# EAGLE design VolRegModule (EAGLE 9.6.2)
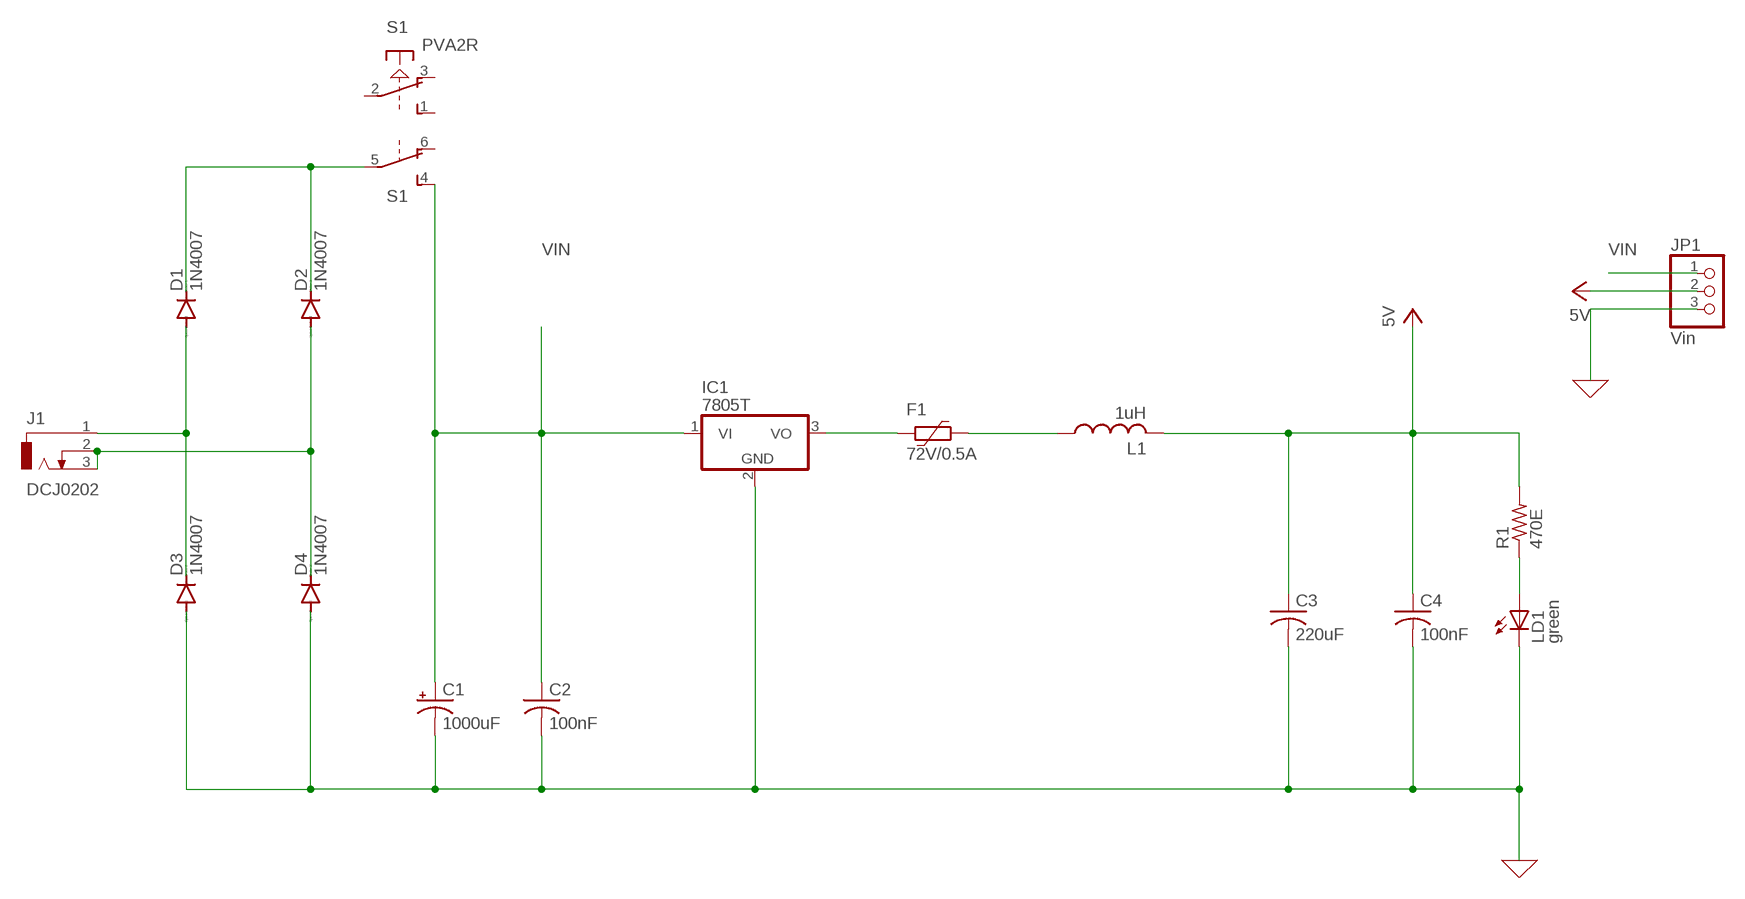
[diagram p0: schematic, sheet 1]

## Parts
C1  1000uF  CPOL-USE5-13  [E5-13]
C2  100nF  C-USC0805  [C0805]
C3  220uF  C-USC0805  [C0805]
C4  100nF  C-USC0805  [C0805]
D1  1N4007  1N4004  [DO41-10]
D2  1N4007  1N4004  [DO41-10]
D3  1N4007  1N4004  [DO41-10]
D4  1N4007  1N4004  [DO41-10]
F1  72V/0.5A  1812L350SL  [1812L]
IC1  7805T  [TO220H]
J1  DCJ0202  [DCJ0202]
JP1  Vin  PINHD-1X03_2.54  [1X03]
L1  1uH  L-USL0805  [L0805]
LD1  green  LEDCHIP-LED0805  [CHIP-LED0805]
R1  470E  R-US_R0805  [R0805]
S1  PVA2R  [PVA2R]

## Nets
0: C1.- C2.2 C3.2 C4.2 D3.A D4.A IC1.2(GND) JP1.3 LD1.C ; supply symbol labelled GND
N$1: D1.A D3.C J1.1
N$2: D1.C D2.C S1.5(2:P)
N$3: F1.2 IC1.3(VO)
N$4: F1.1 L1.1
N$5: D2.A D4.C J1.2 J1.3
N$7: LD1.A R1.1
VCC: C3.1 C4.1 JP1.2 L1.2 R1.2 ; supply symbol labelled 5V
VIN: C1.+ C2.1 IC1.1(VI) JP1.1 S1.4(2:S)
Unconnected: S1.1(1:S) S1.2(1:P) S1.3(1:O) S1.6(2:O)

## Library data of the parts
C1 = rcl:CPOL-US: POLARIZED CAPACITOR, American symbol; SPICEPREFIX: C
C2-C4 = rcl (1):C-US: CAPACITOR, American symbol
D1-D4 = diode:1N4004: DIODE general purpose rectifier, 1 A
F1 = polyfuse-smd_10:?: Polyfuse Resettable PTC Source: http://www.littelfuse.com/products/resettable-ptcs.aspx; MF: Littelfuse; MPN: 1812L350SL; OC_FARNELL: 2125911; OC_NEWARK: 88T7690
IC1 = linear:78*: Positive VOLTAGE REGULATOR Source: http://cache.national.com/ds/LM/LM78L05.pdf http://www.fairchildsemi.com/ds/LM/LM7805.pdf
J1 = con-jack:DCJ0202: DC POWER JACK Source: DCJ0202.pdf; OC_FARNELL: unknown; OC_NEWARK: unknown
JP1 = pinhead-2:PINHD-1X03: PIN HEADER
L1 = rcl (1):L-US: INDUCTOR, American symbol
LD1 = led(1):LED: LED OSRAM: - CHIPLED LG R971, LG N971, LY N971, LG Q971, LY Q971, LO R971, LY R971 LH N974, LH R974 LS Q976, LO Q976, LY Q976 LO Q996 - Hyper CHIPLED LW Q18S LB Q993, LB Q99A, LB R99A - SideLED LS A670, LO A670, LY A670, LG A670, LP A670 LB A673, LV A673, LT A673, LW A673 LH A674 LY A675 LS A676, LA A676, LO A676, LY A676, LW A676 LS A679, LY A679, LG A679 - Hyper Micro SIDELED® LS Y876, LA Y876, LO Y876, LY Y876 LT Y87S - SmartLED LW L88C, LW L88S LB L89C, LB L89S, LG L890 LS L89K, LO L89K, LY L89K LS L896, LA L896, LO L896, LY L896 - TOPLED LS T670, LO T670, LY T670, LG T670, LP T670 LSG T670, LSP T670, LSY T670, LOP T670, LYG T670 LG T671, LOG T671, LSG T671 LB T673, LV T673, LT T673, LW T673 LH T674 LS T676, LA T676, LO T676, LY T676, LB T676, LH T676, LSB T676, LW T676 LB T67C, LV T67C, LT T67C, LS T67K, LO T67K, LY T67K, LW E67C LS E67B, LA E67B, LO E67B, LY E67B, LB E67C, LV E67C, LT E67C LW T67C LS T679, LY T679, LG T679 LS T770, LO T770, LY T770, LG T770, LP T770 LB T773, LV T773, LT T773, LW T773 LH T774 LS E675, LA E675, LY E675, LS T675 LS T776, LA T776, LO T776, LY T776, LB T776 LHGB T686 LT T68C, LB T68C - Hyper Mini TOPLED® LB M676 - Mini TOPLED Santana® LG M470 LS M47K, LO M47K, LY M47K Source: http://www.osram.convergy.de/
R1 = rcl (1):R-US_: RESISTOR, American symbol
S1 = switch-misc:PVA2R: ITT SWITCH

## Board
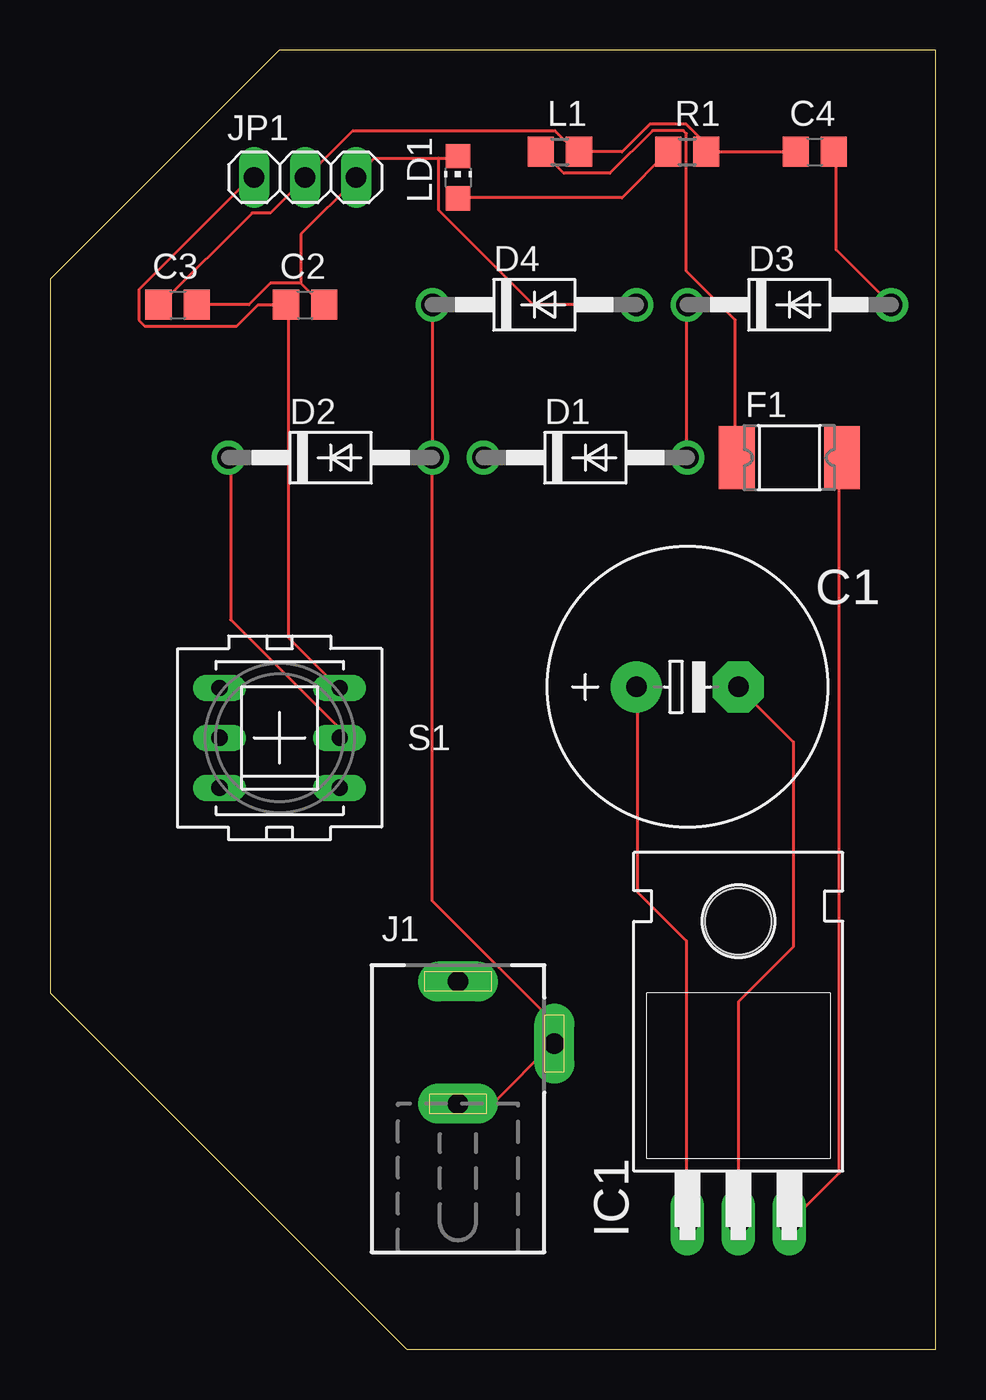
[diagram p1: board, top side]
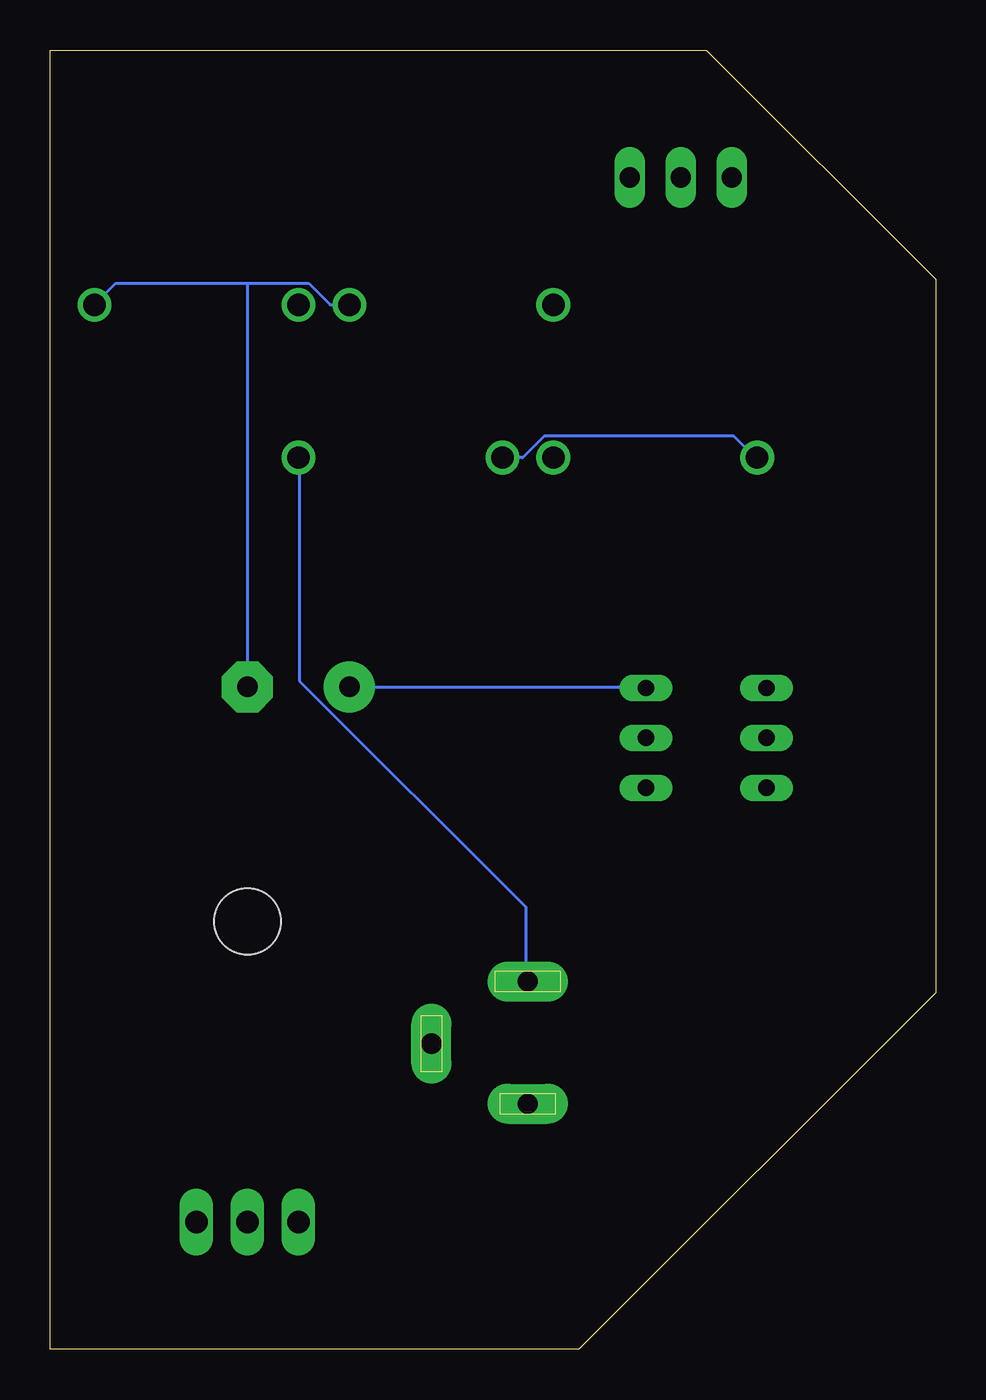
[diagram p2: board, bottom side, seen from below]

Size 44.12 x 64.76 mm. Coordinates in mm from the lower left corner, seen from the top.
Outline: 44.12,0 44.12,64.76 11.42,64.76 0,53.34 0,17.78 17.78,0 44.12,0
Copper layers (1*16): Top 0.035mm / dielectric 1.5mm / Bottom 0.035mm
Design rules "default": minimum track width 6mil, minimum drill 0.35mm, track to track 6mil, track to pad 6mil, pad to pad 6mil, via to via 6mil, smd to smd 6mil, copper to edge 40mil, drill to drill 6mil, minimum pad ring 10mil, minimum via ring 8mil, stop-mask expansion 4mil, vias tented up to drill 0mil, thermal gap 10mil

### Footprints (pad centres in the part's own frame; a part is rotated, then mirrored left to right if it is on the bottom)
E5-13 = drill 1.016 pad 2.54: + -2.54,0 | drill 1.016 pad 2.54 octagon: - 2.54,0
C0805 = smd 1.3 x 1.5: 1 -0.95,0; 2 0.95,0
DO41-10 = drill 1.118: A 5.08,0; C -5.08,0
1812L = smd 1.78 x 3.15: 1 -2.62,0; 2 2.62,0
TO220H = drill 1.118 long: 1 -2.54,-10.16; 2 0,-10.16; 3 2.54,-10.16 | hole 3.302: 0,4.826
DCJ0202 = drill 1 pad 2 long: 1 0,3.1; 2 4.8,0; 3 0,-3
1X03 = drill 1.016 long: 1 -2.54,0; 2 0,0; 3 2.54,0
L0805 = smd 1.3 x 1.5: 1 -0.95,0; 2 0.95,0
CHIP-LED0805 = smd 1.2 x 1.2: A 0,-1.05; C 0,1.05
R0805 = smd 1.3 x 1.5: 1 -0.95,0; 2 0.95,0
PVA2R = drill 0.813 long: 1 -2.997,2.489; 2 -2.997,0; 3 -2.997,-2.489; 4 2.997,2.489; 5 2.997,0; 6 2.997,-2.489

### Placement (x,y rotation side)
C1  31.75,33.02 0 top
C2  12.7,52.07 0 top
C3  6.35,52.07 0 top
C4  38.1,59.69 0 top
D1  26.67,44.45 0 top
D2  13.97,44.45 0 top
D3  36.83,52.07 0 top
D4  24.13,52.07 0 top
F1  36.83,44.45 0 top
IC1  34.29,16.51 0 top
J1  20.32,15.24 0 top
JP1  12.7,58.42 0 top
L1  25.4,59.69 0 top
LD1  20.32,58.42 0 top
R1  31.75,59.69 0 top
S1  11.43,30.48 0 top

### Tracks (layer width: path | path; a pad name or v marks a point on that pad's centre or on a via)
0
  Top 0.152: IC1.2 34.29,17.32 37.03,20.07 37.03,30.28 C1.- | C3.2 9.91,52.07 10.97,53.14 12.5,53.14 | 12.5,53.14 13.56,52.07 C2.2 | 19.36,59.38 16.15,59.38 15.24,58.47 JP1.3 15.24,58.32 12.5,55.57 12.5,53.14 | 19.36,59.38 20.27,59.38 LD1.C | D3.A 39.17,54.81 39.17,59.69 C4.2 | 19.36,59.38 19.36,56.79 24.08,52.07 D4.A
  Bottom 0.152: D4.A 30.17,52.07 31.24,53.14 34.29,53.14 | 34.29,53.14 40.84,53.14 D3.A | 34.29,53.14 C1.-
N$1
  Top 0.152: D1.A 31.7,44.45 31.7,52.07 D3.C
  Bottom 0.152: J1.1 20.42,18.39 20.42,22.05 31.7,33.32 31.7,44.45 D1.A
N$2
  Top 0.152: S1.5 14.33,30.58 14.33,31.04 8.99,36.37 8.99,44.45 D2.C
  Bottom 0.152: D1.C 20.57,44.45 19.51,45.52 10.06,45.52 8.99,44.45 D2.C
N$3
  Top 0.152: F1.2 39.32,44.45 39.32,8.79 36.88,6.35 IC1.3
N$4
  Top 0.152: L1.1 24.54,59.69 25.6,58.62 27.89,58.62 30.02,60.76 31.55,60.76 31.7,60.6 31.7,53.75 34.14,51.31 34.14,44.45 F1.1
N$5
  Top 0.152: D4.C D2.A 19.05,22.35 24.99,16.41 24.99,15.34 J1.2 24.99,15.19 22.1,12.29 20.42,12.29 J1.3
N$7
  Top 0.152: LD1.A 20.42,57.4 28.5,57.4 30.78,59.69 R1.1
VCC
  Top 0.152: C4.1 R1.2 32.61,59.69 32.61,60.15 31.7,61.06 29.87,61.06 28.5,59.69 L1.2 26.21,59.69 25.15,60.76 15.09,60.76 12.8,58.47 JP1.2 12.65,58.32 10.97,56.64 10.06,56.64 5.49,52.07 C3.1
VIN
  Top 0.152: JP1.1 10.06,58.47 4.42,52.83 4.42,51.31 4.72,51 9.3,51 10.36,52.07 C2.1 11.89,52.07 11.89,35.46 14.33,33.02 S1.4 | IC1.1 31.7,6.35 31.7,20.37 29.26,22.81 29.26,33.02 C1.+
  Bottom 0.152: C1.+ 14.48,33.02 S1.4